# Altium schematic sheet LC_FlowPCB_V6.3.SchDoc
size A3
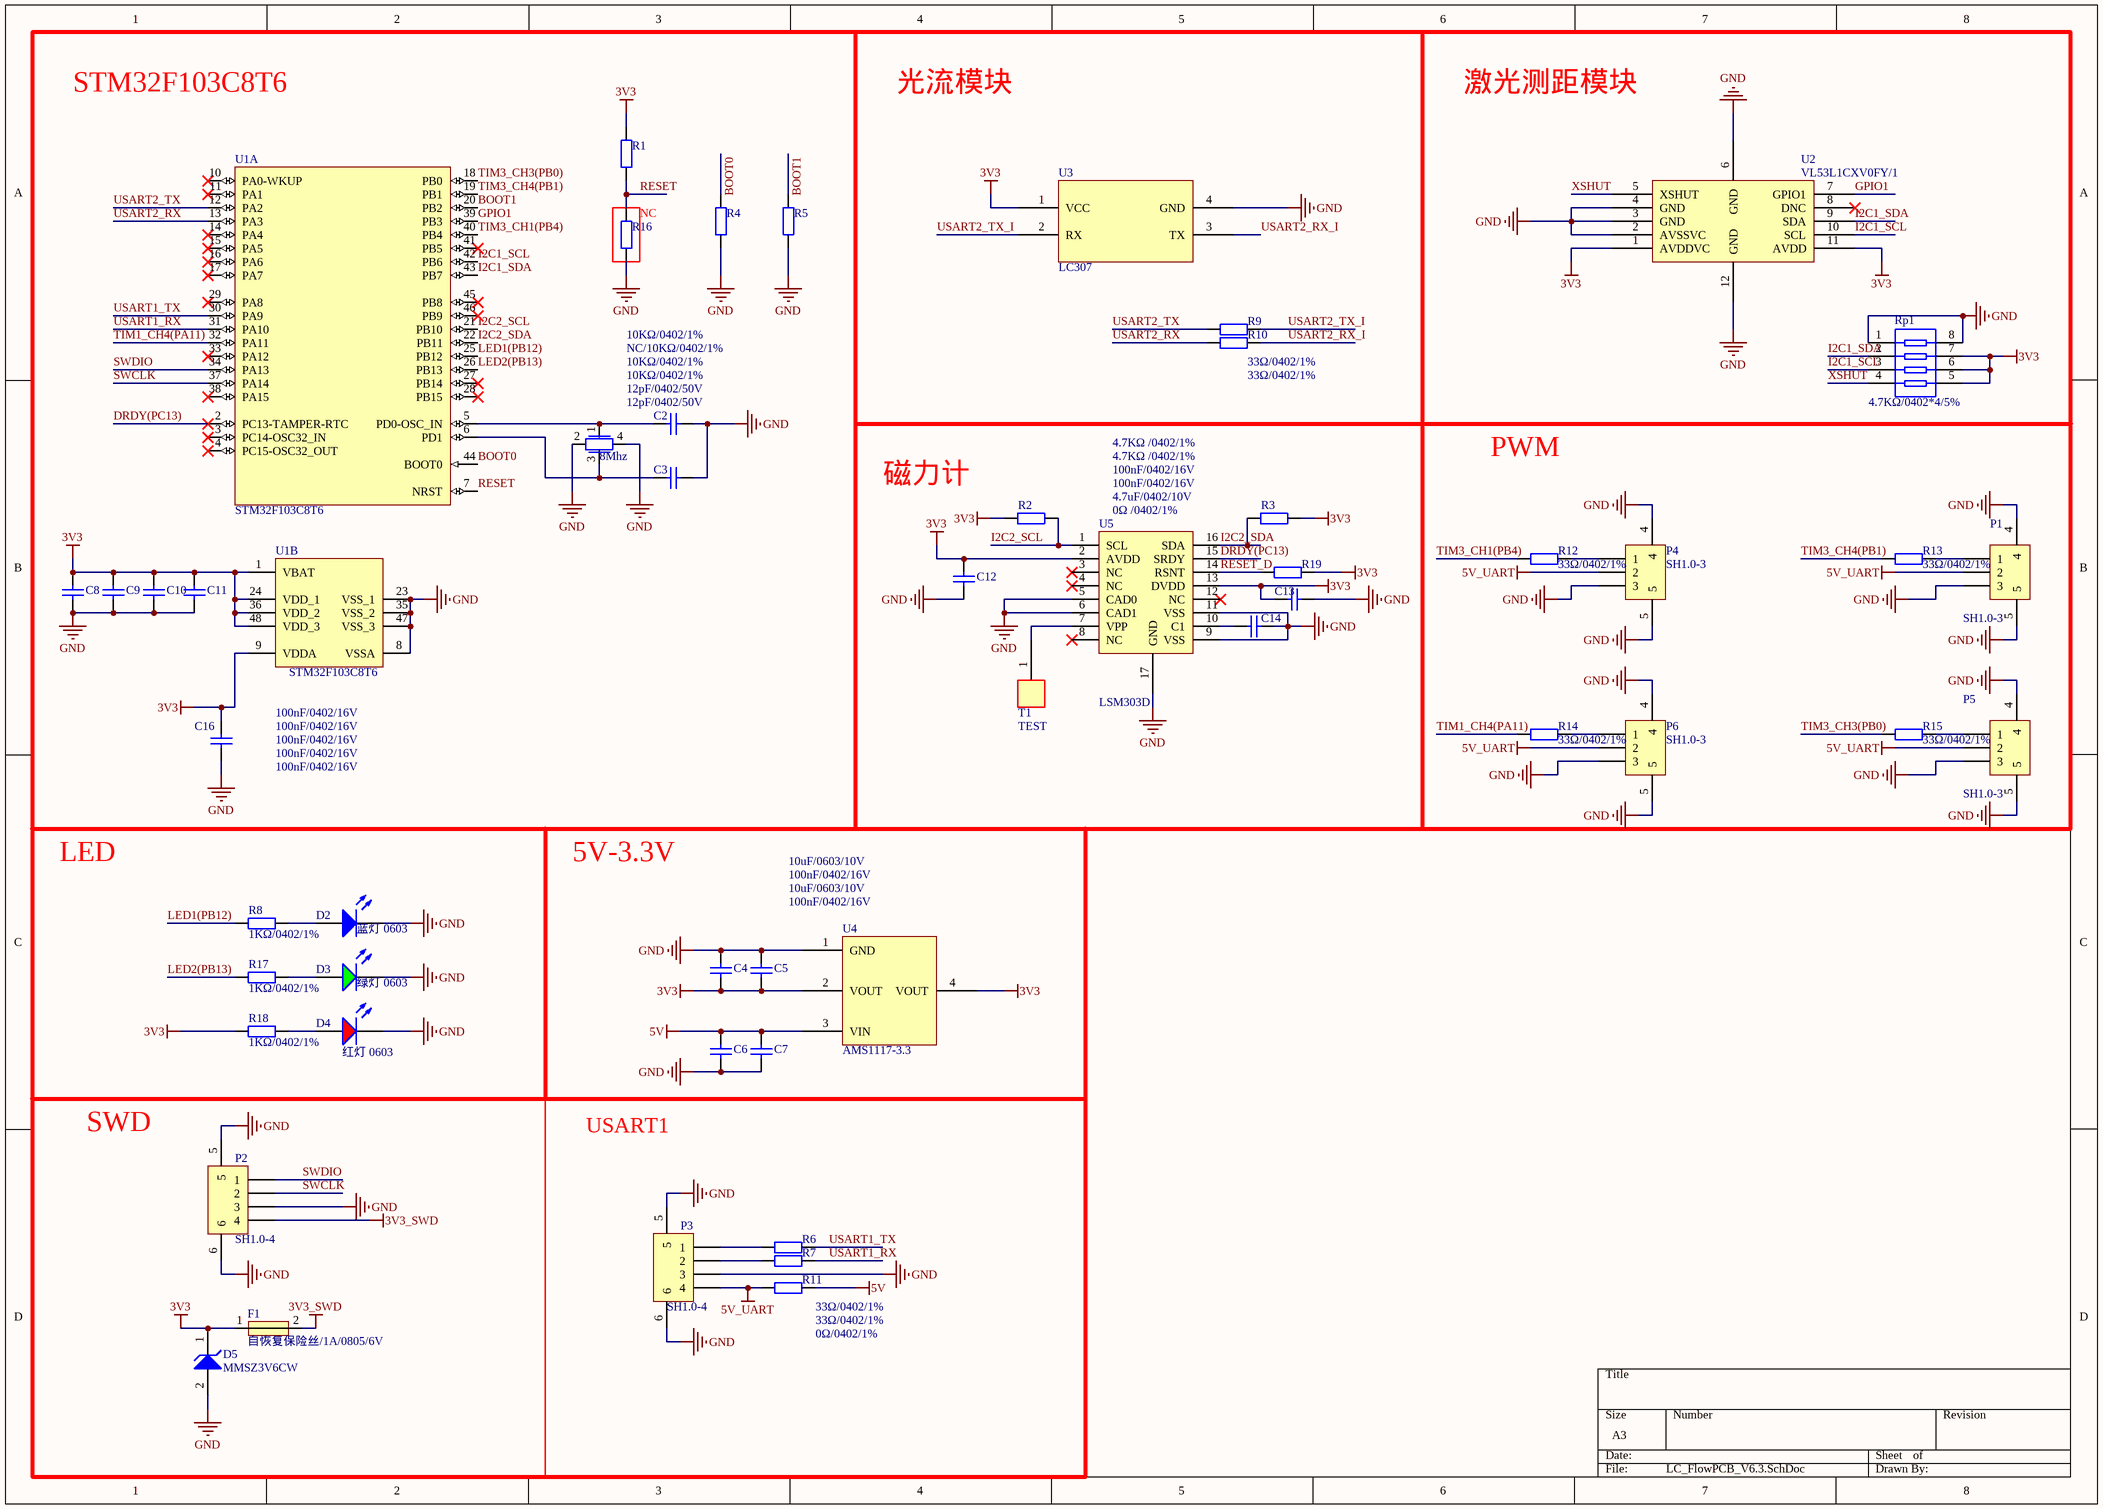
[diagram p0: LC_FlowPCB_V6.3.SchDoc]

## Parts
8Mhz  无源贴片晶振  [SMD-3225_4P]  (value not drawn)
C2  12pF/0402/50V  [0402_C]
C3  12pF/0402/50V  [0402_C]
C4  10uF/0603/10V  [0603_C]
C5  100nF/0402/16V  [0402_C]
C6  10uF/0603/10V  [0603_C]
C7  100nF/0402/16V  [0402_C]
C8  100nF/0402/16V  [0402_C]
C9  100nF/0402/16V  [0402_C]
C10  100nF/0402/16V  [0402_C]
C11  100nF/0402/16V  [0402_C]
C12  100nF/0402/16V  [0402_C]
C13  100nF/0402/16V  [0402_C]
C14  4.7uF/0402/10V  [0402_C]
C16  100nF/0402/16V  [0402_C]
D2  蓝灯 0603  [0603_LED_S1]
D3  绿灯 0603  [0603_LED_S1]
D4  红灯 0603  [0603_LED_S1]
D5  MMSZ3V6CW  [SOD-123]
F1  自恢复保险丝/1A/0805/6V  [0805_R]
P1  SH1.0-3  [SH1.0-WS-3P]
P2  SH1.0-4  [SH1.0-WS-4P]
P3  SH1.0-4  [SH1.0-WS-4P]
P4  SH1.0-3  [SH1.0-WS-3P]
P5  SH1.0-3  [SH1.0-WS-3P]
P6  SH1.0-3  [SH1.0-WS-3P]
R1  10KΩ/0402/1%  [0402_R]
R2  4.7KΩ /0402/1%  [0402_R]
R3  4.7KΩ /0402/1%  [0402_R]
R4  10KΩ/0402/1%  [0402_R]
R5  10KΩ/0402/1%  [0402_R]
R6  33Ω/0402/1%  [0402_R]
R7  33Ω/0402/1%  [0402_R]
R8  1KΩ/0402/1%  [0402_R]
R9  33Ω/0402/1%  [0402_R]
R10  33Ω/0402/1%  [0402_R]
R11  0Ω/0402/1%  [0402_R]
R12  33Ω/0402/1%  [0402_R]
R13  33Ω/0402/1%  [0402_R]
R14  33Ω/0402/1%  [0402_R]
R15  33Ω/0402/1%  [0402_R]
R16  NC/10KΩ/0402/1%  [0402_R]
R17  1KΩ/0402/1%  [0402_R]
R18  1KΩ/0402/1%  [0402_R]
R19  0Ω /0402/1%  [0402_R]
Rp1  4.7KΩ/0402*4/5%  [0402_Rx4]
T1  TEST  [测试点]
U1  STM32F103C8T6  [LQFP-48_7x7x05P]  (parts A,B of 2)
U2  VL53L1CXV0FY/1  [LGA-12-2.5X4.9MM]
U3  LC307  [LC307]
U4  AMS1117-3.3  [SOT223]
U5  LSM303D  [QFN-16 (3×3)]

## Nets
3V3: C4.1 C5.1 C8.2 C9.2 C10.2 C11.2 C12.2 C13.2 C16.2 D5.1(K) F1.1 R1.2 R2.2 R3.2 R18.1 R19.2 Rp1.5 Rp1.6 Rp1.7 U1.1(VBAT) U1.9(VDDA) U1.24(VDD_1) U1.36(VDD_2) U1.48(VDD_3) U2.1(AVDDVC) U2.11(AVDD) U3.1(VCC) U4.2(VOUT) U4.4(VOUT) U5.2(AVDD) U5.13(DVDD)
3V3_SWD: F1.2 P2.4
5V: C6.2 C7.2 R11.2 U4.3(VIN)
5V_UART: P1.2 P3.4 P4.2 P5.2 P6.2 R11.1
GND: 8Mhz.2(GND) 8Mhz.4(GND) C2.2 C3.2 C4.2 C5.2 C6.1 C7.1 C8.1 C9.1 C10.1 C11.1 C12.1 C13.1 C14.2 C16.1 D2.K D3.K D4.K D5.2(A) P1.3 P1.4 P1.5 P2.3 P2.5 P2.6 P3.3 P3.5 P3.6 P4.3 P4.4 P4.5 P5.3 P5.4 P5.5 P6.3 P6.4 P6.5 R4.1 R5.1 R16.1 Rp1.1 Rp1.8 U1.8(VSSA) U1.23(VSS_1) U1.35(VSS_2) U1.47(VSS_3) U2.2(AVSSVC) U2.3(GND) U2.4(GND) U2.6(GND) U2.12(GND) U3.4(GND) U4.1(GND) U5.5(CAD0) U5.6(CAD1) U5.9(VSS) U5.11(VSS) U5.17(GND)
BOOT0: R4.2 U1.44(BOOT0)
BOOT1: R5.2 U1.20(PB2)
DRDY(PC13): U1.2(PC13-TAMPER-RTC) U5.15(SRDY)
GPIO1: U1.39(PB3) U2.7(GPIO1)
I2C1_SCL: Rp1.3 U1.42(PB6) U2.10(SCL)
I2C1_SDA: Rp1.2 U1.43(PB7) U2.9(SDA)
I2C2_SCL: R2.1 U1.21(PB10) U5.1(SCL)
I2C2_SDA: R3.1 U1.22(PB11) U5.16(SDA)
LED1(PB12): R8.1 U1.25(PB12)
LED2(PB13): R17.1 U1.26(PB13)
RESET: R1.1 R16.2 U1.7(NRST)
RESET_D: R19.1 U5.14(RSNT)
SWCLK: P2.2 U1.37(PA14)
SWDIO: P2.1 U1.34(PA13)
TIM1_CH4(PA11): R14.2 U1.32(PA11)
TIM3_CH1(PB4): R12.2 U1.40(PB4)
TIM3_CH3(PB0): R15.2 U1.18(PB0)
TIM3_CH4(PB1): R13.2 U1.19(PB1)
USART1_RX: R7.2 U1.31(PA10)
USART1_TX: R6.2 U1.30(PA9)
USART2_RX: R10.1 U1.13(PA3)
USART2_RX_I: R10.2 U3.3(TX)
USART2_TX: R9.1 U1.12(PA2)
USART2_TX_I: R9.2 U3.2(RX)
XSHUT: Rp1.4 U2.5(XSHUT)
Net8Mhz_1: 8Mhz.1(OUT) C2.1 U1.5(PD0-OSC_IN)
Net8Mhz_3: 8Mhz.3(OUT) C3.1 U1.6(PD1)
NetC14_1: C14.1 U5.10(C1)
NetD2_A: D2.A R8.2
NetD3_A: D3.A R17.2
NetD4_A: D4.A R18.2
NetP1_1: P1.1 R13.1
NetP3_1: P3.1 R6.1
NetP3_2: P3.2 R7.1
NetP4_1: P4.1 R12.1
NetP5_1: P5.1 R15.1
NetP6_1: P6.1 R14.1
NetT1_1: T1.1(VIN) U5.7(VPP)

Not connected (* = marked no-connect by the designer): U1 3(PC14-OSC32_IN)* 4(PC15-OSC32_OUT)* 10(PA0-WKUP)* 11(PA1)* 14(PA4)* 15(PA5)* 16(PA6)* 17(PA7)* 27(PB14)* 28(PB15)* 29(PA8)* 33(PA12)* 38(PA15)* 41(PB5)* 45(PB8)* 46(PB9)*; U2 8(DNC)*; U5 3(NC)* 4(NC)* 8(NC)* 12(NC)*

## Notes on the sheet
- STM32F103C8T6
- 光流模块
- 激光测距模块
- (near R16) NC
- 磁力计
- PWM
- LED
- 5V-3.3V
- SWD
- USART1

## Library data of the parts
8Mhz = XTAL_4: 25M/3225
C2 C3 = 0402 22pF (220) 5% 50V: 贴片电容; ComponentLink1Description: 供应商链接; ComponentLink1URL: http://www.szlcsc.com/product/details_1907.html; Package: 0402; Supplier: LC; SuppliersPartNumber: C1555
C4 C6 = 0603 10uF (106) 10% 10V: 贴片电容; ComponentLink1Description: 供应商链接; ComponentLink1URL: http://www.szlcsc.com/product/details_20411.html; Package: 0603; Supplier: LC; SuppliersPartNumber: C19702
C5 C7-C13 C16 = 0402 100nF (104) 10% 16V: 贴片电容; ComponentLink1Description: 供应商链接; ComponentLink1URL: http://www.szlcsc.com/product/details_1877.html; Package: 0402; Supplier: LC; SuppliersPartNumber: C1525
C14 = 0402 4.7uF (475) 20% 10V: 贴片电容; ComponentLink1Description: 供应商链接; ComponentLink1URL: http://www.szlcsc.com/product/details_24469.html; Package: 0402; Supplier: LC; SuppliersPartNumber: C23733
D2 = 0603 蓝灯: 发光二极管; ComponentLink1Description: 供应商链接; ComponentLink1URL: http://www.szlcsc.com/product/details_73150.html; Package: 0603; Supplier: LC; SuppliersPartNumber: C72041
D3 = 0603 绿灯: 发光二极管; ComponentLink1Description: 供应商链接; ComponentLink1URL: http://www.szlcsc.com/product/details_73152.html; Package: 0603; Supplier: LC; SuppliersPartNumber: C72043
D4 = 0603 红灯: 发光二极管; ComponentLink1Description: 供应商链接; ComponentLink1URL: http://www.szlcsc.com/product/details_2659.html; Package: 0603; Supplier: LC; SuppliersPartNumber: C2286
D5 = LL-34 ZMM3V3: 稳压二极管; ComponentLink1Description: 供应商链接; ComponentLink1URL: http://www.szlcsc.com/product/details_8535.html; Package: LL-34; Supplier: LC; SuppliersPartNumber: C8056
F1 = FUSE/0805
P1 P4-P6 = SH1.0-3: Header, 3-Pin; LatestRevisionDate: 17-Jul-2002; LatestRevisionNote: Re-released for DXP Platform.; Publisher: Altium Limited
P2 P3 = SH1.0-4: Header, 4-Pin; LatestRevisionDate: 17-Jul-2002; LatestRevisionNote: Re-released for DXP Platform.; Publisher: Altium Limited
R1 R4 R5 R16 = 0402 10KΩ (1002) 1%: 贴片电阻; ComponentLink1Description: 供应商链接; ComponentLink1URL: http://www.szlcsc.com/product/details_26487.html; Package: 0402; Supplier: LC; SuppliersPartNumber: C25744
R2 R3 R19 = 0402 4.7KΩ (4701) 1%: 贴片电阻; ComponentLink1Description: 供应商链接; ComponentLink1URL: http://www.szlcsc.com/product/details_26643.html; Package: 0402; Supplier: LC; SuppliersPartNumber: C25900
R6 R7 R9-R15 = 0402 33Ω (33R0) 1%: 贴片电阻; ComponentLink1Description: 供应商链接; ComponentLink1URL: http://www.szlcsc.com/product/details_25848.html; Package: 0402; Supplier: LC; SuppliersPartNumber: C25105
R8 R17 R18 = 0402 1KΩ (1001) 1%: 贴片电阻; ComponentLink1Description: 供应商链接; ComponentLink1URL: http://www.szlcsc.com/product/details_12256.html; Package: 0402; Supplier: LC; SuppliersPartNumber: C11702
Rp1 = 0402*4 1KΩ (102) 5%_1: 贴片排阻; ComponentLink1Description: 供应商链接; ComponentLink1URL: http://www.szlcsc.com/product/details_26469.html; Package: 0402*4; Supplier: LC; SuppliersPartNumber: C25726
T1 = 测试点
U1 = STM32F103C8T6: ARM; ComponentLink1Description: 供应商链接; ComponentLink1URL: http://www.szlcsc.com/product/details_9243.html; Package: LQFP-48_7x7x05P; Supplier: LC; SuppliersPartNumber: C8734
U2 = VL53L1CXV0FY/1: 激光测距模块
U3 = LC307: 光流模块
U4 = AMS1117-3.3: LDO
U5 = IST8310: 磁力计